# Altium schematic sheet MainBoard.SchDoc
size A4
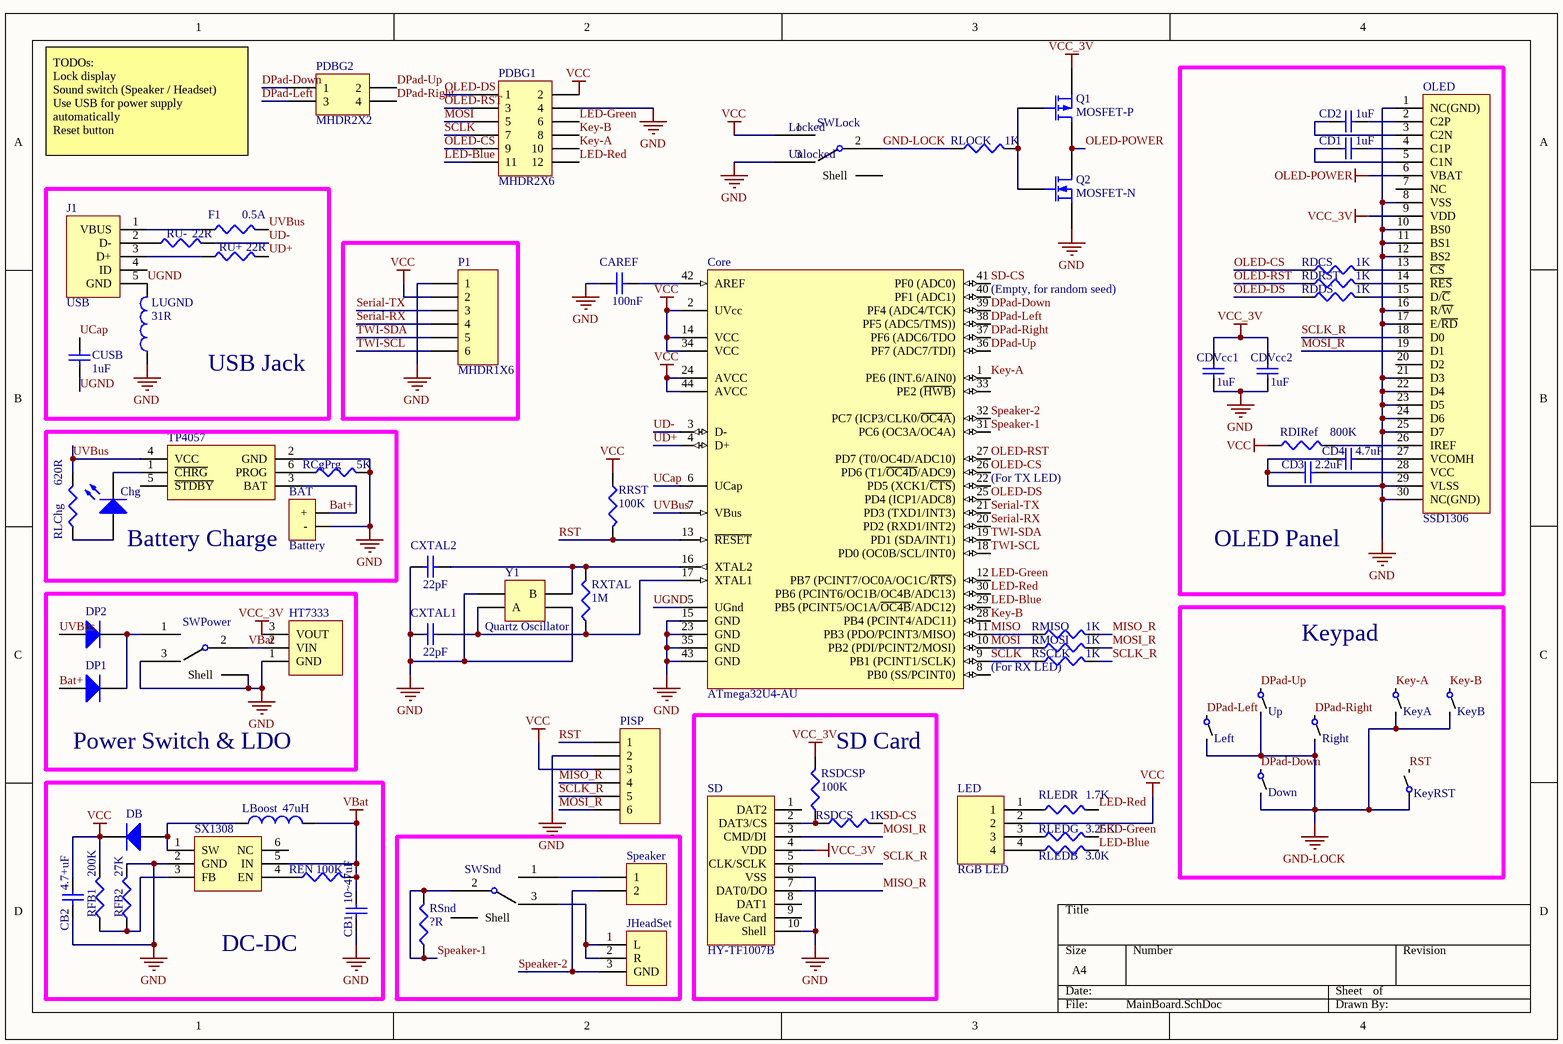
[diagram p0: MainBoard.SchDoc]

## Parts
BAT  Battery  [BAT-2]
CAREF  value 100nF  [1608[0603]]  (hidden comment: Cap Semi)
CB1  value 10~47uF  [1608[0603]]  (hidden comment: Cap Semi)
CB2  value 4.7+uF  [1608[0603]]  (hidden comment: Cap Semi)
CD1  value 1uF  [1608[0603]]  (hidden comment: Cap Semi)
CD2  value 1uF  [1608[0603]]  (hidden comment: Cap Semi)
CD3  value 2.2uF  [1608[0603]]  (hidden comment: Cap Semi)
CD4  value 4.7uF  [1608[0603]]  (hidden comment: Cap Semi)
CDVcc1  value 1uF  [1608[0603]]  (hidden comment: Cap Semi)
CDVcc2  value 1uF  [1608[0603]]  (hidden comment: Cap Semi)
Chg  LED1  [LED-1]  (value not drawn)
Core  ATmega32U4-AU  [44ML_N]
CUSB  value 1uF  [1608[0603]]  (hidden comment: Cap Semi)
CXTAL1  value 22pF  [1608[0603]]  (hidden comment: Cap Semi)
CXTAL2  value 22pF  [1608[0603]]  (hidden comment: Cap Semi)
DB  Diode  [D0603]  (value not drawn)
Down  MicroSwitch  [Switch_changeable]  (value not drawn)
DP1  Diode  [D0603]  (value not drawn)
DP2  Diode  [D0603]  (value not drawn)
F1  value 0.5A  [J1-0603]  (hidden comment: Fuse 0.5A)
HT7333  HT7333  [SOT89N]  (value not drawn)
J1  USB  [USBMicroF]
JHeadSet  Headset  [PJ-313D-2]  (value not drawn)
KeyA  MicroSwitch  [Switch_changeable]  (value not drawn)
KeyB  MicroSwitch  [Switch_changeable]  (value not drawn)
KeyRST  MicroSwitch  [MICROSWITCH-STAND]  (value not drawn)
LBoost  value 47uH  [CDRH3D16]  (hidden comment: Inductor)
LED  RGB LED  [RGBLED]
Left  MicroSwitch  [Switch_changeable]  (value not drawn)
LUGND  value 31R  [1608[0603]]  (hidden comment: Inductor)
OLED  SSD1306  [SSD1306]
P1  MHDR1X6  [MHDR1X6]
PDBG1  MHDR2X6  [MHDR2X6_NOMK]
PDBG2  MHDR2X2  [MHDR2X2_NOMK]
PISP  MHDR1X6  [MHDR1X6]  (value not drawn)
Q1  MOSFET-P  [SOT23_N]
Q2  MOSFET-N  [SOT23_N]
RCgPrg  value 5K  [J1-0603]  (hidden comment: Res3)
RDCS  value 1K  [J1-0603]  (hidden comment: Res3)
RDDS  value 1K  [J1-0603]  (hidden comment: Res3)
RDIRef  value 800K  [J1-0603]  (hidden comment: Res3)
RDRST  value 1K  [J1-0603]  (hidden comment: Res3)
REN  value 100K  [J1-0603]  (hidden comment: Res3)
RFB1  value 200K  [J1-0603]  (hidden comment: Res3)
RFB2  value 27K  [J1-0603]  (hidden comment: Res3)
Right  MicroSwitch  [Switch_changeable]  (value not drawn)
RLChg  value 620R  [J1-0603]  (hidden comment: Res3)
RLEDB  value 3.0K  [J1-0603]  (hidden comment: Res3)
RLEDG  value 3.25K  [J1-0603]  (hidden comment: Res3)
RLEDR  value 1.7K  [J1-0603]  (hidden comment: Res3)
RLOCK  value 1K  [J1-0603]  (hidden comment: Res3)
RMISO  value 1K  [J1-0603]  (hidden comment: Res3)
RMOSI  value 1K  [J1-0603]  (hidden comment: Res3)
RRST  value 100K  [J1-0603]  (hidden comment: Res3)
RSCLK  value 1K  [J1-0603]  (hidden comment: Res3)
RSDCS  value 1K  [J1-0603]  (hidden comment: Res3)
RSDCSP  value 100K  [J1-0603]  (hidden comment: Res3)
RSnd  value ?R  [J1-0603]  (hidden comment: Res3)
RU+  value 22R  [J1-0603]  (hidden comment: Res3)
RU-  value 22R  [J1-0603]  (hidden comment: Res3)
RXTAL  value 1M  [J1-0603]  (hidden comment: Res3)
SD  HY-TF1007B  [HY-TF1007B]
Speaker  Header 2  [HDR1X2]  (value not drawn)
SWLock  MSK-1103_W13  [MSK-1103_W13]  (value not drawn)
SWPower  MSK-1103_W13  [MSK-1103_W13]  (value not drawn)
SWSnd  MSK-1103_W13  [MSK-1103_W13]  (value not drawn)
SX1308  SX1308  [SOT23-6_N]  (value not drawn)
TP4057  TP4057  [SOT23-6_L]  (value not drawn)
Up  MicroSwitch  [Switch_changeable]  (value not drawn)
Y1  Quartz Oscillator  [3225Quartz_Crystal]

## Blocks framed on the sheet
OLED Panel: CD1-CD4 CDVcc1 CDVcc2 OLED RDCS RDDS RDIRef RDRST
USB Jack: CUSB F1 J1 LUGND RU+ RU-
Battery Charge: BAT Chg RCgPrg RLChg TP4057
Power Switch & LDO: DP1 DP2 HT7333 SWPower
Keypad: Down KeyA KeyB KeyRST Left Right Up
SD Card: RSDCS RSDCSP SD
DC-DC: CB1 CB2 DB LBoost REN RFB1 RFB2 SX1308

## Nets
GND: BAT.2(-) CAREF.1 CB1.1 CB2.1 CD3.1 CD4.1 CDVcc1.2 CDVcc2.2 Core.15(GND) Core.23(GND) Core.35(GND) Core.43(GND) CXTAL1.1 CXTAL2.1 HT7333.1(GND) LUGND.1 OLED.1(NC(GND)) OLED.8(VSS) OLED.10(BS0) OLED.11(BS1) OLED.12(BS2) OLED.16(R/~{W}) OLED.17(E/~{RD}) OLED.21(D3) OLED.22(D4) OLED.23(D5) OLED.24(D6) OLED.25(D7) OLED.29(VLSS) OLED.30(NC(GND)) P1.1 PDBG1.4 PISP.2 Q2.3(S) RCgPrg.2 RFB2.2 SD.6(VSS) SD.10(Shell) SWLock.3 SWPower.3 SWPower.4(Shell) SX1308.2(GND) TP4057.2(GND) Y1.2 Y1.4
GND-LOCK: Down.2 KeyA.2 KeyB.2 KeyRST.1 Left.2 Right.2 RLOCK.1 SWLock.2 Up.2
OLED-POWER: OLED.6(VBAT) Q1.1(D) Q2.1(D)
VBat: CB1.2 HT7333.2(VIN) LBoost.2 REN.2 SWPower.2 SX1308.5(IN)
VCC: CB2.2 Core.2(UVcc) Core.14(VCC) Core.24(AVCC) Core.34(VCC) Core.44(AVCC) DB.2(K) LED.2 P1.2 PDBG1.2 PISP.3 RDIRef.1 RFB1.2 RRST.1 SWLock.1
VCC_3V: CDVcc1.1 CDVcc2.1 HT7333.3(VOUT) OLED.9(VDD) Q1.3(S) RSDCSP.2 SD.4(VDD)
Bat+: BAT.1(+) DP1.1(A) TP4057.3(BAT)
DPad-Down: Core.39(PF4_(ADC4/TCK)) Down.1 PDBG2.1
DPad-Left: Core.38(PF5_(ADC5/TMS))) Left.1 PDBG2.3
DPad-Right: Core.37(PF6_(ADC6/TDO) PDBG2.4 Right.1
DPad-Up: Core.36(PF7_(ADC7/TDI)) PDBG2.2 Up.1
Key-A: Core.1(PE6_(INT.6/AIN0)) KeyA.1 PDBG1.10
Key-B: Core.28(PB4_(PCINT4/ADC11)) KeyB.1 PDBG1.8
LED-Blue: Core.29(PB5_(PCINT5/OC1A/~{OC4B}/ADC12)) PDBG1.11 RLEDB.2
LED-Green: Core.12(PB7_(PCINT7/OC0A/OC1C/~{RTS})) PDBG1.6 RLEDG.2
LED-Red: Core.30(PB6_(PCINT6/OC1B/OC4B/ADC13)) PDBG1.12 RLEDR.2
MISO: Core.11(PB3_(PDO/PCINT3/MISO)) RMISO.1
MISO_R: PISP.4 RMISO.2 SD.7(DAT0/DO)
MOSI: Core.10(PB2_(PDI/PCINT2/MOSI)) PDBG1.5 RMOSI.1
MOSI_R: OLED.19(D1) PISP.6 RMOSI.2 SD.3(CMD/DI)
OLED-CS: Core.26(PD6_(T1/~{OC4D}/ADC9)) PDBG1.9 RDCS.1
OLED-DS: Core.25(PD4_(ICP1/ADC8)) PDBG1.1 RDDS.1
OLED-RST: Core.27(PD7_(T0/OC4D/ADC10)) PDBG1.3 RDRST.1
RST: Core.13(~{RESET}) KeyRST.2 PISP.1 RRST.2
SCLK: Core.9(PB1_(PCINT1/SCLK)) PDBG1.7 RSCLK.1
SCLK_R: OLED.18(D0) PISP.5 RSCLK.2 SD.5(CLK/SCLK)
SD-CS: Core.41(PF0_(ADC0)) RSDCS.2
Serial-RX: Core.20(PD2_(RXD1/INT2)) P1.4
Serial-TX: Core.21(PD3_(TXD1/INT3)) P1.3
Speaker-1: Core.31(PC6_(OC3A/OC4A)) RSnd.1 RSnd.2 SWSnd.2
Speaker-2: Core.32(PC7_(ICP3/CLK0/~{OC4A})) JHeadSet.3(GND) Speaker.2
TWI-SCL: Core.18(PD0_(OC0B/SCL/INT0)) P1.6
TWI-SDA: Core.19(PD1_(SDA/INT1)) P1.5
UCap: Core.6(UCap) CUSB.1
UD+: Core.4(D+) RU+.2
UD-: Core.3(D-) RU-.2
UGND: Core.5(UGnd) CUSB.2 J1.5(GND) LUGND.2
UVBus: Core.7(VBus) DP2.1(A) F1.2 RLChg.2 TP4057.4(VCC)
NetCAREF_2: CAREF.2 Core.42(AREF)
NetCD1_1: CD1.1 OLED.5(C1N)
NetCD1_2: CD1.2 OLED.4(C1P)
NetCD2_1: CD2.1 OLED.3(C2N)
NetCD2_2: CD2.2 OLED.2(C2P)
NetCD3_2: CD3.2 OLED.28(VCC)
NetCD4_2: CD4.2 OLED.27(VCOMH)
NetChg_1: Chg.1(A) RLChg.1
NetChg_2: Chg.2(K) TP4057.1(~{CHRG})
NetCore_16: Core.16(XTAL2) CXTAL2.2 RXTAL.2 Y1.3(B)
NetCore_17: Core.17(XTAL1) CXTAL1.2 RXTAL.1 Y1.1(A)
NetDB_1: DB.1(A) LBoost.1 SX1308.1(SW)
NetDP1_2: DP1.2(K) DP2.2(K) SWPower.1
NetF1_1: F1.1 J1.1(VBUS)
NetJ1_2: J1.2(D-) RU-.1
NetJ1_3: J1.3(D+) RU+.1
NetJHeadSet_1: JHeadSet.1(L) JHeadSet.2(R) SWSnd.3
NetLED_1: LED.1 RLEDR.1
NetLED_3: LED.3 RLEDG.1
NetLED_4: LED.4 RLEDB.1
NetOLED_13: OLED.13(~{CS}) RDCS.2
NetOLED_14: OLED.14(~{RES}) RDRST.2
NetOLED_15: OLED.15(D/~{C}) RDDS.2
NetOLED_26: OLED.26(IREF) RDIRef.2
NetQ1_2: Q1.2(G) Q2.2(G) RLOCK.2
NetRCgPrg_1: RCgPrg.1 TP4057.6(PROG)
NetREN_1: REN.1 SX1308.4(EN)
NetRFB1_1: RFB1.1 RFB2.1 SX1308.3(FB)
NetRSDCS_1: RSDCS.1 RSDCSP.1 SD.2(DAT3/CS)
NetSpeaker_1: Speaker.1 SWSnd.1

Not connected (* = marked no-connect by the designer): Core 8(PB0_(SS/PCINT0)) 22(PD5_(XCK1/~{CTS})) 33(PE2_(~{HWB})) 40(PF1_(ADC1)); J1 4(ID); OLED 7(NC) 20(D2); SD 1(DAT2) 8(DAT1) 9(Have_Card); SWLock 4(Shell); SWSnd 4(Shell); SX1308 6(NC); TP4057 5(~{STDBY})

## Notes on the sheet
- TODOs:
  Lock display
  Sound switch (Speaker / Headset)
  Use USB for power supply automatically
  Reset button
- (near SWLock) Locked
- (near SWLock) Unlocked
- (near Core) (Empty, for random seed)
- (near Core) (For TX LED)
- (near RSCLK) (For RX LED)

## Library data of the parts
CAREF CB1 CB2 CD1-CD4 CDVcc1 CDVcc2 CUSB CXTAL1 CXTAL2 = Cap Semi: Capacitor (Semiconductor SIM Model); Published: 8-Jun-2000; LatestRevisionDate: 29-May-2009; LatestRevisionNote: IPC-7351 Footprint Added.; PackageReference: C1206; Publisher: Altium Limited; PackageDescription: Chip Capacitor
Chg = LED1: Typical RED GaAs LED; Published: 8-Jun-2000; LatestRevisionDate: 08-Jul-2005; LatestRevisionNote: Mech Layer 1 removed.; PackageReference: LED-1; Publisher: Altium Limited; PackageDescription: LED; 2 Leads
Core = ATmega32U4-AU: 8-bit AVR Microcontroller, 2.7-5.5V, 32KB Flash, 2.5KB EEPROM, 1KB SRAM, USB Controller, 44-pin TQFP, Industrial Grade (-40癈 to 85癈); Published: 1-Apr-2010; DatasheetVersion: revD, Jan-2009; PackageVersion: rev.G, Jul-2007; PackageReference: 44ML; Publisher: Altium Limited; PackageDescription: 44-Pin Plastic Thin Quad Flat Pack, 10 x 10 x 1.0 mm Body, 0.8 mm Pitch (TQFP); Supplier 1: Digi-Key; Supplier Part Number 1: ATMEGA32U4-AU-ND; Supplier 2: Farnell; Supplier Part Number 2: 1748525; Supplier 3: Mouser; Supplier Part Number 3: 556-ATMEGA32U4-AU; ComponentLink1Description: Manufacturer Link; ComponentLink1URL: http://www.atmel.com/products/avr/default.asp?; ComponentLink2Description: ATmega16U4/32U4 Datasheet; ComponentLink2URL: http://www.atmel.com/dyn/resources/prod_documents/doc7766.pdf; ComponentLink3Description: ATmega16U4 ATmega32U4 Summary; ComponentLink3URL: http://www.atmel.com/dyn/resources/prod_documents/7766S.pdf; ComponentLink4Description: Atmel.com Home; ComponentLink4URL: http://www.atmel.com
DB DP1 DP2 = Diode: Default Diode; Published: 8-Jun-2000; LatestRevisionDate: 17-Jul-2002; LatestRevisionNote: Re-released for DXP Platform.; PackageVersion: Sep-1996; PackageReference: SMC; Publisher: Altium Limited; PackageDescription: DO-214-AB/SMC; 2 C-Bend Leads; Body 7.9 x 5.9 mm, inc. leads (LxW); Code_JEDEC: DO-214-AB
Down KeyA KeyB KeyRST Left Right Up = MicroSwitch: Micro Switch
F1 = Res3: Fuse; Published: 8-Jun-2000; LatestRevisionDate: 29-May-2009; LatestRevisionNote: IPC-7351 Footprint Added.; PackageReference: J1-0603; Publisher: Altium Limited; PackageDescription: Chip Resistor
HT7333 = HT7333: 3.3v LDO Regulator
J1 = USBMicroF: USB Micro Female Jack
JHeadSet = PJ-313D: 3.5mm Headset Jack
LBoost LUGND = Inductor: Code_IEC: 1005; Published: 8-Jun-2000; LatestRevisionDate: 29-May-2009; LatestRevisionNote: IPC-7351 Footprint Added.; PackageReference: 0402-A; Publisher: Altium Limited; PackageDescription: Chip Inductor; Code_JEITA: 0402
LED = RGBLED
OLED = SSD1306: OLED Controller
P1 PISP = MHDR1X6: Header, 6-Pin; LatestRevisionDate: 17-Jul-2002; LatestRevisionNote: Re-released for DXP Platform.; Publisher: Altium Limited
PDBG1 = MHDR2X6: Header, 6-Pin, Dual row; LatestRevisionDate: 17-Jul-2002; LatestRevisionNote: Re-released for DXP Platform.; Publisher: Altium Limited
PDBG2 = MHDR2X2: Header, 2-Pin, Dual row; LatestRevisionDate: 17-Jul-2002; LatestRevisionNote: Re-released for DXP Platform.; Publisher: Altium Limited
Q1 = MOSFET-P: P-Channel MOSFET; pin to pad: 2>3 3>2; Published: 8-Jun-2000; LatestRevisionDate: 17-Jul-2002; LatestRevisionNote: Re-released for DXP Platform.; PackageVersion: 1995/1996; PackageReference: E3; Publisher: Altium Limited; PackageDescription: TO, Flat Index; 3 In-Line, Axial Leads; Body Dia. 4.6mm; Lead Dia. 0.5 mm (max)
Q2 = MOSFET-N: N-Channel MOSFET; pin to pad: 2>3 3>2; Published: 8-Jun-2000; LatestRevisionDate: 17-Jul-2002; LatestRevisionNote: Re-released for DXP Platform.; PackageVersion: 1995/1996; PackageReference: E3; Publisher: Altium Limited; PackageDescription: TO, Flat Index; 3 In-Line, Axial Leads; Body Dia. 4.6mm; Lead Dia. 0.5 mm (max)
RCgPrg RDCS RDDS RDIRef RDRST REN RFB1 RFB2 RLChg RLEDB RLEDG RLEDR RLOCK RMISO RMOSI RRST RSCLK RSDCS RSDCSP RSnd RU+ RU- RXTAL = Res3: Resistor; Published: 8-Jun-2000; LatestRevisionDate: 29-May-2009; LatestRevisionNote: IPC-7351 Footprint Added.; PackageReference: J1-0603; Publisher: Altium Limited; PackageDescription: Chip Resistor
SD = HY-TF1007B: Micro SD Card Slot
Speaker = Header 2: Header, 2-Pin; LatestRevisionDate: 17-Jul-2002; LatestRevisionNote: Re-released for DXP Platform.; Publisher: Altium Limited
SWLock SWPower SWSnd = MSK-1103_W13: Switch
SX1308 = SX1308: Boost DC-DC
Y1 = OSC3225